# Altium project System.PrjPCB
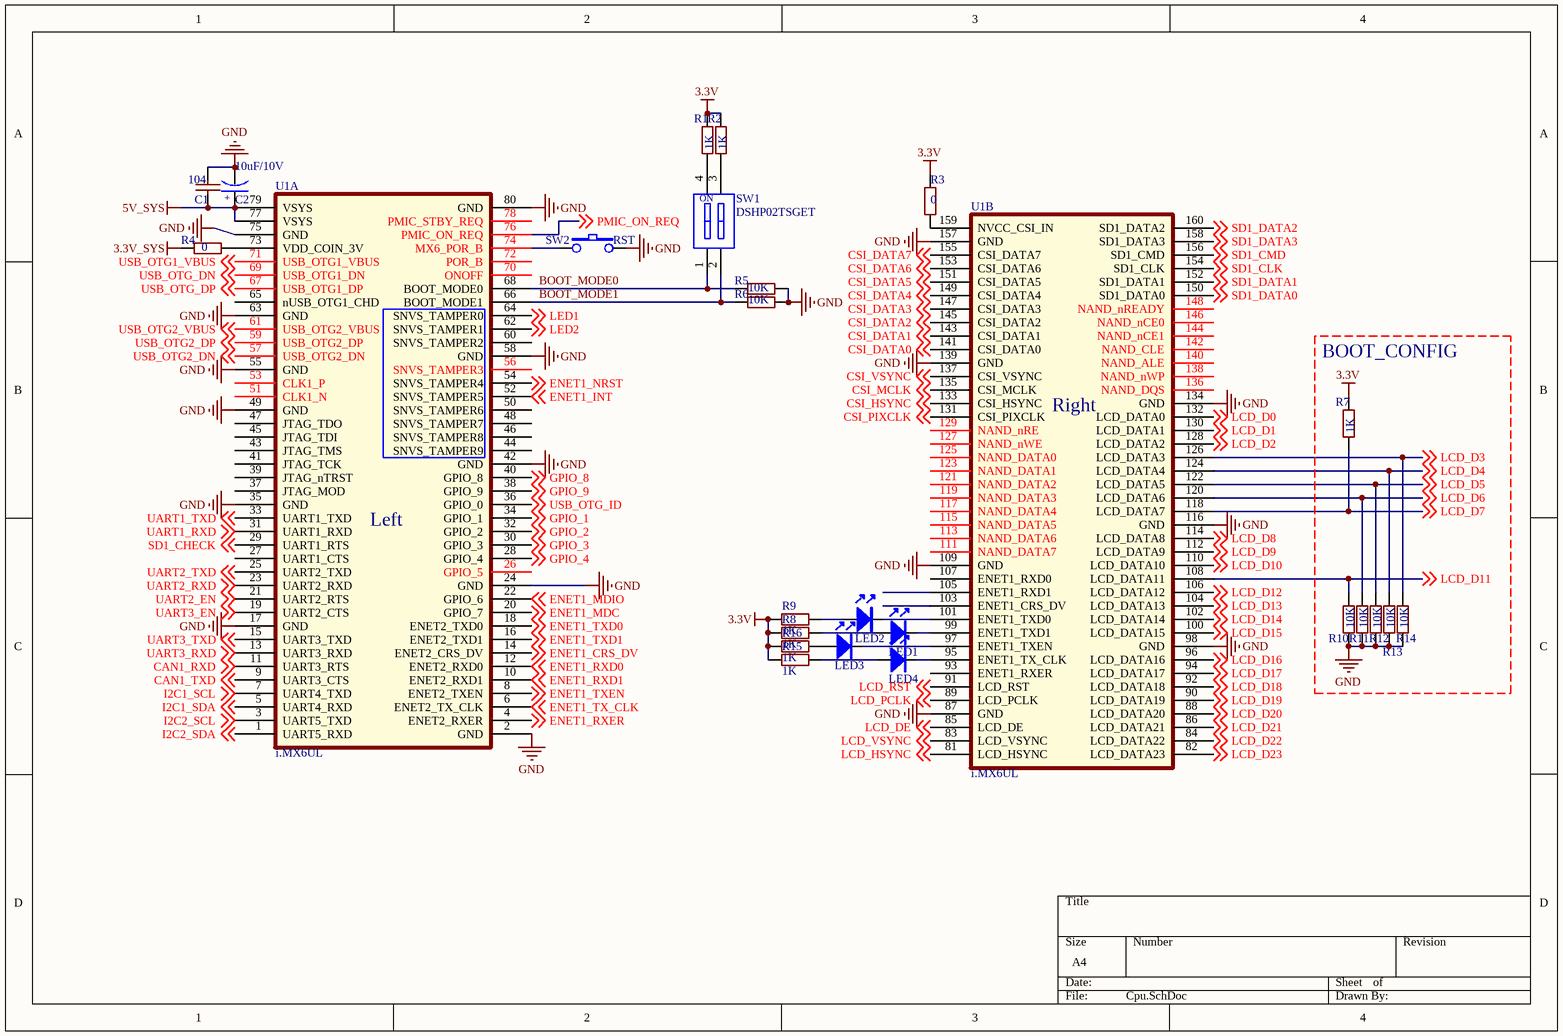
[diagram p0: Cpu.SchDoc]
6 sheets, 152 parts. Net scope: global (net labels, ports and power ports of the same name join across sheets).
Board file: System.PcbDoc
Sheets:
  Cpu.SchDoc
  Net.SchDoc
  Power.SchDoc
  Usb_SdCard.SchDoc
  Uart_Can.SchDoc
  Gpio_RTC.SchDoc

## Sheet Cpu.SchDoc
size A4

### Parts
(Parts that share a designator on the sheet are numbered #1, #2 ... from top to bottom, then left to right.)
C1  104  [0805SMD_Cap]
C2  10uF/10V  [CASE A]
LED1  LED  [发光二极管0805]  (value not drawn)
LED2  LED  [发光二极管0805]  (value not drawn)
LED3  LED  [发光二极管0805]  (value not drawn)
LED4  LED  [发光二极管0805]  (value not drawn)
R1  1K  [0805_SMD_R]
R2  1K  [0805_SMD_R]
R3  0  [0805_SMD_R]
R4  0  [0805_SMD_R]
R5#1  10K  [0805_SMD_R]
R6#1  10K  [0805_SMD_R]
R7#1  1K  [0805_SMD_R]
R8  1K  [0805_SMD_R]
R9  1K  [0805_SMD_R]
R10  10K  [0805_SMD_R]
R11  10K  [0805_SMD_R]
R12  10K  [0805_SMD_R]
R13  10K  [0805_SMD_R]
R14  10K  [0805_SMD_R]
R15  1K  [0805_SMD_R]
R16  1K  [0805_SMD_R]
SW1  DSHP02TSGET  [DSHP02TSGET]
SW2  RST  [SW4]
U1  i.MX6UL  [i.MX6_PCB]  (parts A,B of 2)

### Blocks framed on the sheet
BOOT_CONFIG: R7#1 R10-R14

### Nets
3.3V: R1.2 R2.2 R3.1 R7#1.2 R8.1 R9.1 R15.2 R16.2
3.3V_SYS: R4.2
5V_SYS: C1.2 C2.1 U1.77(VSYS) U1.79(VSYS)
GND: C1.1 C2.2 R5#1.1 R6#1.1 R10.1 R11.1 R12.1 R13.1 R14.1 SW2.2 U1.2(GND) U1.17(GND) U1.24(GND) U1.35(GND) U1.42(GND) U1.49(GND) U1.55(GND) U1.58(GND) U1.63(GND) U1.75(GND) U1.80(GND) U1.87(GND) U1.98(GND) U1.109(GND) U1.116(GND) U1.134(GND) U1.139(GND) U1.157(GND)
BOOT_MODE0: R5#1.2 SW1.1(A1) U1.68(BOOT_MODE0)
BOOT_MODE1: R6#1.2 SW1.2(A2) U1.66(BOOT_MODE1)
CAN1_RXD: U1.11(UART3_RTS) ; off-sheet CAN1_RXD
CAN1_TXD: U1.9(UART3_CTS) ; off-sheet CAN1_TXD
CSI_DATA0: U1.141(CSI_DATA0) ; off-sheet CSI_DATA0
CSI_DATA1: U1.143(CSI_DATA1) ; off-sheet CSI_DATA1
CSI_DATA2: U1.145(CSI_DATA2) ; off-sheet CSI_DATA2
CSI_DATA3: U1.147(CSI_DATA3) ; off-sheet CSI_DATA3
CSI_DATA4: U1.149(CSI_DATA4) ; off-sheet CSI_DATA4
CSI_DATA5: U1.151(CSI_DATA5) ; off-sheet CSI_DATA5
CSI_DATA6: U1.153(CSI_DATA6) ; off-sheet CSI_DATA6
CSI_DATA7: U1.155(CSI_DATA7) ; off-sheet CSI_DATA7
CSI_HSYNC: U1.133(CSI_HSYNC) ; off-sheet CSI_HSYNC
CSI_MCLK: U1.135(CSI_MCLK) ; off-sheet CSI_MCLK
CSI_PIXCLK: U1.131(CSI_PIXCLK) ; off-sheet CSI_PIXCLK
CSI_VSYNC: U1.137(CSI_VSYNC) ; off-sheet CSI_VSYNC
ENET1_CRS_DV: U1.14(ENET2_CRS_DV) ; off-sheet ENET1_CRS_DV
ENET1_INT: U1.52(SNVS_TAMPER5) ; off-sheet ENET1_INT
ENET1_MDC: U1.20(GPIO_7) ; off-sheet ENET1_MDC
ENET1_MDIO: U1.22(GPIO_6) ; off-sheet ENET1_MDIO
ENET1_NRST: U1.54(SNVS_TAMPER4) ; off-sheet ENET1_NRST
ENET1_RXD0: U1.12(ENET2_RXD0) ; off-sheet ENET1_RXD0
ENET1_RXD1: U1.10(ENET2_RXD1) ; off-sheet ENET1_RXD1
ENET1_RXER: U1.4(ENET2_RXER) ; off-sheet ENET1_RXER
ENET1_TX_CLK: U1.6(ENET2_TX_CLK) ; off-sheet ENET1_TX_CLK
ENET1_TXD0: U1.18(ENET2_TXD0) ; off-sheet ENET1_TXD0
ENET1_TXD1: U1.16(ENET2_TXD1) ; off-sheet ENET1_TXD1
ENET1_TXEN: U1.8(ENET2_TXEN) ; off-sheet ENET1_TXEN
GPIO_1: U1.34(GPIO_1) ; off-sheet GPIO_1
GPIO_2: U1.32(GPIO_2) ; off-sheet GPIO_2
GPIO_3: U1.30(GPIO_3) ; off-sheet GPIO_3
GPIO_4: U1.28(GPIO_4) ; off-sheet GPIO_4
GPIO_8: U1.40(GPIO_8) ; off-sheet GPIO_8
GPIO_9: U1.38(GPIO_9) ; off-sheet GPIO_9
I2C1_SCL: U1.7(UART4_TXD) ; off-sheet I2C1_SCL
I2C1_SDA: U1.5(UART4_RXD) ; off-sheet I2C1_SDA
I2C2_SCL: U1.3(UART5_TXD) ; off-sheet I2C2_SCL
I2C2_SDA: U1.1(UART5_RXD) ; off-sheet I2C2_SDA
LCD_D0: U1.132(LCD_DATA0) ; off-sheet LCD_D0
LCD_D1: U1.130(LCD_DATA1) ; off-sheet LCD_D1
LCD_D2: U1.128(LCD_DATA2) ; off-sheet LCD_D2
LCD_D3: R14.2 U1.126(LCD_DATA3) ; off-sheet LCD_D3
LCD_D4: R13.2 U1.124(LCD_DATA4) ; off-sheet LCD_D4
LCD_D5: R12.2 U1.122(LCD_DATA5) ; off-sheet LCD_D5
LCD_D6: R11.2 U1.120(LCD_DATA6) ; off-sheet LCD_D6
LCD_D7: R7#1.1 U1.118(LCD_DATA7) ; off-sheet LCD_D7
LCD_D8: U1.114(LCD_DATA8) ; off-sheet LCD_D8
LCD_D9: U1.112(LCD_DATA9) ; off-sheet LCD_D9
LCD_D10: U1.110(LCD_DATA10) ; off-sheet LCD_D10
LCD_D11: R10.2 U1.108(LCD_DATA11) ; off-sheet LCD_D11
LCD_D12: U1.106(LCD_DATA12) ; off-sheet LCD_D12
LCD_D13: U1.104(LCD_DATA13) ; off-sheet LCD_D13
LCD_D14: U1.102(LCD_DATA14) ; off-sheet LCD_D14
LCD_D15: U1.100(LCD_DATA15) ; off-sheet LCD_D15
LCD_D16: U1.96(LCD_DATA16) ; off-sheet LCD_D16
LCD_D17: U1.94(LCD_DATA17) ; off-sheet LCD_D17
LCD_D18: U1.92(LCD_DATA18) ; off-sheet LCD_D18
LCD_D19: U1.90(LCD_DATA19) ; off-sheet LCD_D19
LCD_D20: U1.88(LCD_DATA20) ; off-sheet LCD_D20
LCD_D21: U1.86(LCD_DATA21) ; off-sheet LCD_D21
LCD_D22: U1.84(LCD_DATA22) ; off-sheet LCD_D22
LCD_D23: U1.82(LCD_DATA23) ; off-sheet LCD_D23
LCD_DE: U1.85(LCD_DE) ; off-sheet LCD_DE
LCD_HSYNC: U1.81(LCD_HSYNC) ; off-sheet LCD_HSYNC
LCD_PCLK: U1.89(LCD_PCLK) ; off-sheet LCD_PCLK
LCD_RST: U1.91(LCD_RST) ; off-sheet LCD_RST
LCD_VSYNC: U1.83(LCD_VSYNC) ; off-sheet LCD_VSYNC
LED1: U1.64(SNVS_TAMPER0) ; off-sheet LED1
LED2: U1.62(SNVS_TAMPER1) ; off-sheet LED2
PMIC_ON_REQ: U1.76(PMIC_ON_REQ) ; off-sheet PMIC_ON_REQ
SD1_CHECK: U1.29(UART1_RTS) ; off-sheet SD1_CHECK
SD1_CLK: U1.154(SD1_CLK) ; off-sheet SD1_CLK
SD1_CMD: U1.156(SD1_CMD) ; off-sheet SD1_CMD
SD1_DATA0: U1.150(SD1_DATA0) ; off-sheet SD1_DATA0
SD1_DATA1: U1.152(SD1_DATA1) ; off-sheet SD1_DATA1
SD1_DATA2: U1.160(SD1_DATA2) ; off-sheet SD1_DATA2
SD1_DATA3: U1.158(SD1_DATA3) ; off-sheet SD1_DATA3
UART1_RXD: U1.31(UART1_RXD) ; off-sheet UART1_RXD
UART1_TXD: U1.33(UART1_TXD) ; off-sheet UART1_TXD
UART2_EN: U1.21(UART2_RTS) ; off-sheet UART2_EN
UART2_RXD: U1.23(UART2_RXD) ; off-sheet UART2_RXD
UART2_TXD: U1.25(UART2_TXD) ; off-sheet UART2_TXD
UART3_EN: U1.19(UART2_CTS) ; off-sheet UART3_EN
UART3_RXD: U1.13(UART3_RXD) ; off-sheet UART3_RXD
UART3_TXD: U1.15(UART3_TXD) ; off-sheet UART3_TXD
USB_OTG1_VBUS: U1.71(USB_OTG1_VBUS) ; off-sheet USB_OTG1_VBUS
USB_OTG2_DN: U1.57(USB_OTG2_DN) ; off-sheet USB_OTG2_DN
USB_OTG2_DP: U1.59(USB_OTG2_DP) ; off-sheet USB_OTG2_DP
USB_OTG2_VBUS: U1.61(USB_OTG2_VBUS) ; off-sheet USB_OTG2_VBUS
USB_OTG_DN: U1.69(USB_OTG1_DN) ; off-sheet USB_OTG_DN
USB_OTG_DP: U1.67(USB_OTG1_DP) ; off-sheet USB_OTG_DP
USB_OTG_ID: U1.36(GPIO_0) ; off-sheet USB_OTG_ID
NetLED1_A: LED1.A R8.2
NetLED1_K: LED1.K U1.99(ENET1_TXD1)
NetLED2_A: LED2.A R9.2
NetLED2_K: LED2.K U1.101(ENET1_TXD0)
NetLED3_A: LED3.A R16.1
NetLED3_K: LED3.K U1.97(ENET1_TXEN)
NetLED4_A: LED4.A R15.1
NetLED4_K: LED4.K U1.95(ENET1_TX_CLK)
NetR1_1: R1.1 SW1.4(B1)
NetR2_1: R2.1 SW1.3(B2)
NetR3_2: R3.2 U1.159(NVCC_CSI_IN)
NetR4_1: R4.1 U1.73(VDD_COIN_3V)
NetSW2_1: SW2.1 U1.74(MX6_POR_B)

Not connected (* = marked no-connect by the designer): U1 26(GPIO_5) 27(UART1_CTS) 37(JTAG_MOD) 39(JTAG_nTRST) 41(JTAG_TCK) 43(JTAG_TMS) 44(SNVS_TAMPER9) 45(JTAG_TDI) 46(SNVS_TAMPER8) 47(JTAG_TDO) 48(SNVS_TAMPER7) 50(SNVS_TAMPER6) 51(CLK1_N) 53(CLK1_P) 56(SNVS_TAMPER3) 60(SNVS_TAMPER2) 65(nUSB_OTG1_CHD) 70(ONOFF) 72(POR_B) 78(PMIC_STBY_REQ) 93(ENET1_RXER) 103(ENET1_CRS_DV) 105(ENET1_RXD1) 107(ENET1_RXD0) 111(NAND_DATA7) 113(NAND_DATA6) 115(NAND_DATA5) 117(NAND_DATA4) 119(NAND_DATA3) 121(NAND_DATA2) 123(NAND_DATA1) 125(NAND_DATA0) 127(NAND_nWE) 129(NAND_nRE) 136(NAND_DQS) 138(NAND_nWP) 140(NAND_ALE) 142(NAND_CLE) 144(NAND_nCE1) 146(NAND_nCE0) 148(NAND_nREADY)

### Notes on the sheet
- (in symbol CAP  POL) +
- (in symbol i.MX6_Sch, part A) Left
- (in symbol i.MX6_Sch, part B) Right
- (in symbol 拨码开关) ON

### Library data of the parts
C1 = SMD_Cap: 贴片电容; 研究所: 贴装电容_0805_0.1uF; 松下: GR21BB1H104K; 松下: GR21BB1H224K; 松下: GR21BB1H103K; 研究所: 贴装电容_0805_0.22uF; 研究所: 贴装电容_0805_0.01uF; 松下: GR21BB1H473K; 研究所: 贴装电容_0805_0.047uF; 松下: GR21BB1H300K; 研究所: 贴装电容_0805_30pF; 松下: GR21BB1H105K; 研究所: 贴装电容_0805_1uF; 松下: GR21BB1H472K; 研究所: 贴装电容_0805_4700pF
C2 = CAP  POL: 电解电容; Value: R1HCX010MT50
LED1-LED4 = LED: 发光二极管
R1-R4 R5#1 R6#1 R7#1 R8-R16 = SMD_0805: 贴片电阻; 松下: RS05K101FT; 松下: RS05000FT; 松下: RS05K3321FT; 松下: RS05K6811FT; 松下: RS05K102FT; 松下: RS05K2211FT; 松下: RS05K103FT; 松下: RS05K5111FT; 松下: RS05K5110FT; 松下: RS05K5112FT; 松下: RS05K8251FT; 松下: RS05K2212FT; 松下: RS05K104FT; 松下: RS05K5113FT; 松下: RS05K105FT; 松下: RS05L106FT; 研究所: 贴装电阻_0805_0_F1%; 研究所: 贴装电阻_0805_100_F1%; 研究所: 贴装电阻_0805_51.1K_F1%; 研究所: 贴装电阻_0805_1K_F1%; 研究所: 贴装电阻_0805_2.21K_F1%; 研究所: 贴装电阻_0805_3.32K_F1%; 研究所: 贴装电阻_0805_5.11K_F1%; 研究所: 贴装电阻_0805_511K_F1%; 研究所: 贴装电阻_0805_6.81K_F1%; 研究所: 贴装电阻_0805_511_F1%; 研究所: 贴装电阻_0805_8.25K_F1%; 研究所: 贴装电阻_0805_10K_F1%; 研究所: 贴装电阻_0805_22.1K_F1%; 研究所: 贴装电阻_0805_100K_F1%; 研究所: 贴装电阻_0805_1M_F1%; 研究所: 贴装电阻_0805_10M_F1%
SW1 = 拨码开关
SW2 = Button: 按键12*12*7.3
U1 = i.MX6_Sch

## Sheet Net.SchDoc: 网络接口
size A4; Author: 陈世豪
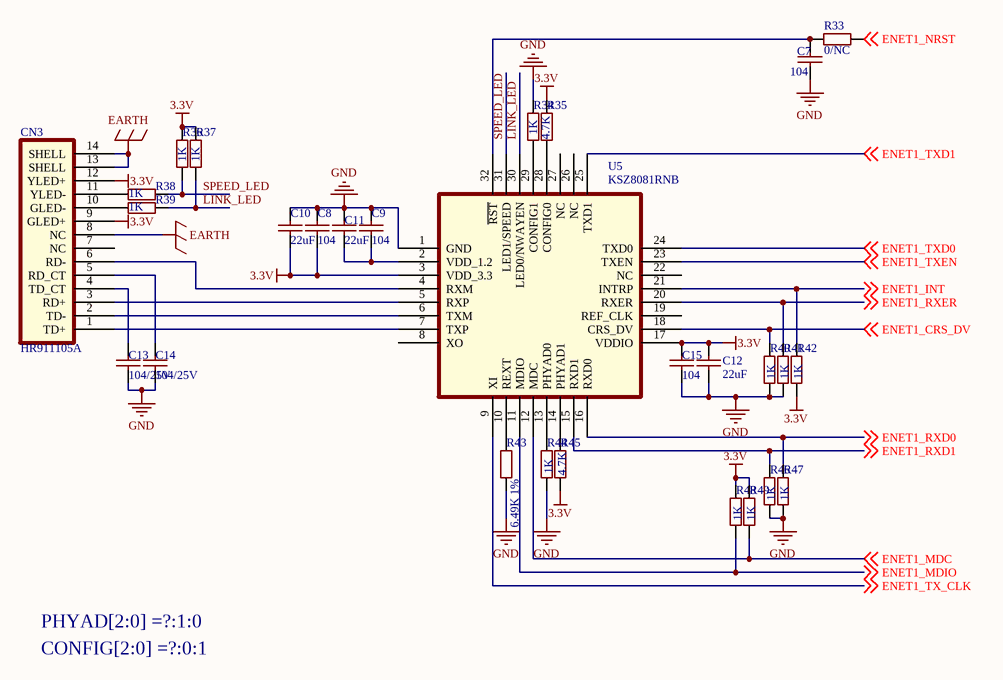
[diagram p1: Net.SchDoc]

### Parts
C7  104  [0805SMD_Cap]
C8  104  [0805SMD_Cap]
C9  104  [0805SMD_Cap]
C10  22uF  [0805SMD_Cap]
C11  22uF  [0805SMD_Cap]
C12  22uF  [0805SMD_Cap]
C13  104/25V  [0805SMD_Cap]
C14  104/25V  [0805SMD_Cap]
C15  104  [0805SMD_Cap]
CN3  HR911105A  [RJ-45A12]
R33  0/NC  [0805_SMD_R]
R34  1K  [0805_SMD_R]
R35  4.7K  [0805_SMD_R]
R36  1K  [0805_SMD_R]
R37  1K  [0805_SMD_R]
R38  1K  [0805_SMD_R]
R39  1K  [0805_SMD_R]
R40  1K  [0805_SMD_R]
R41  1K  [0805_SMD_R]
R42  1K  [0805_SMD_R]
R43  6.49K 1%  [0805_SMD_R]
R44  1K  [0805_SMD_R]
R45  4.7K  [0805_SMD_R]
R46  1K  [0805_SMD_R]
R47  1K  [0805_SMD_R]
R48  1K  [0805_SMD_R]
R49  1K  [0805_SMD_R]
U5  KSZ8081RNB  [LC-QFN-32_5x5x05P]

### Nets
3.3V: C8.2 C10.1 C12.1 C15.2 CN3.9(GLED+) CN3.12(YLED+) R35.2 R36.2 R37.2 R42.2 R45.2 R48.2 R49.2 U5.3(VDD_3.3) U5.17(VDDIO)
EARTH: CN3.8(NC) CN3.13(SHELL) CN3.14(SHELL)
GND: C7.1 C8.1 C9.1 C10.2 C11.2 C12.2 C13.1 C14.1 C15.1 R34.2 R40.1 R41.1 R43.1 R44.1 R46.1 R47.1 U5.1(GND)
ENET1_CRS_DV: R40.2 U5.18(CRS_DV) ; off-sheet ENET1_CRS_DV
ENET1_INT: R42.1 U5.21(INTRP) ; off-sheet ENET1_INT
ENET1_MDC: R49.1 U5.12(MDC) ; off-sheet ENET1_MDC
ENET1_MDIO: R48.1 U5.11(MDIO) ; off-sheet ENET1_MDIO
ENET1_NRST: R33.1 ; off-sheet ENET1_NRST
ENET1_RXD0: R47.2 U5.16(RXD0) ; off-sheet ENET1_RXD0
ENET1_RXD1: R46.2 U5.15(RXD1) ; off-sheet ENET1_RXD1
ENET1_RXER: R41.2 U5.20(RXER) ; off-sheet ENET1_RXER
ENET1_TX_CLK: U5.9(XI) ; off-sheet ENET1_TX_CLK
ENET1_TXD0: U5.24(TXD0) ; off-sheet ENET1_TXD0
ENET1_TXD1: U5.25(TXD1) ; off-sheet ENET1_TXD1
ENET1_TXEN: U5.23(TXEN) ; off-sheet ENET1_TXEN
LINK_LED: R37.1 R39.2 U5.30(LED0/NWAYEN)
SPEED_LED: R36.1 R38.2 U5.31(LED1/SPEED)
NetC7_2: C7.2 R33.2 U5.32(~{RST})
NetC9_2: C9.2 C11.1 U5.2(VDD_1.2)
NetC13_2: C13.2 CN3.4(TD_CT)
NetC14_2: C14.2 CN3.5(RD_CT)
NetCN3_1: CN3.1(TD+) U5.7(TXP)
NetCN3_2: CN3.2(TD-) U5.6(TXM)
NetCN3_3: CN3.3(RD+) U5.5(RXP)
NetCN3_6: CN3.6(RD-) U5.4(RXM)
NetCN3_10: CN3.10(GLED-) R39.1
NetCN3_11: CN3.11(YLED-) R38.1
NetR34_1: R34.1 U5.29(CONFIG1)
NetR35_1: R35.1 U5.28(CONFIG0)
NetR43_2: R43.2 U5.10(REXT)
NetR44_2: R44.2 U5.13(PHYAD0)
NetR45_1: R45.1 U5.14(PHYAD1)

Not connected (* = marked no-connect by the designer): CN3 7(NC); U5 8(XO) 19(REF_CLK) 22(NC) 26(NC) 27(NC)

### Notes on the sheet
- PHYAD[2:0] =?:1:0
- CONFIG[2:0] =?:0:1

### Library data of the parts
C7-C15 = SMD_Cap: 贴片电容; 研究所: 贴装电容_0805_4700pF; 松下: GR21BB1H472K
R33-R49 = SMD_0805: as R1 on sheet Cpu

## Sheet Power.SchDoc
size A4
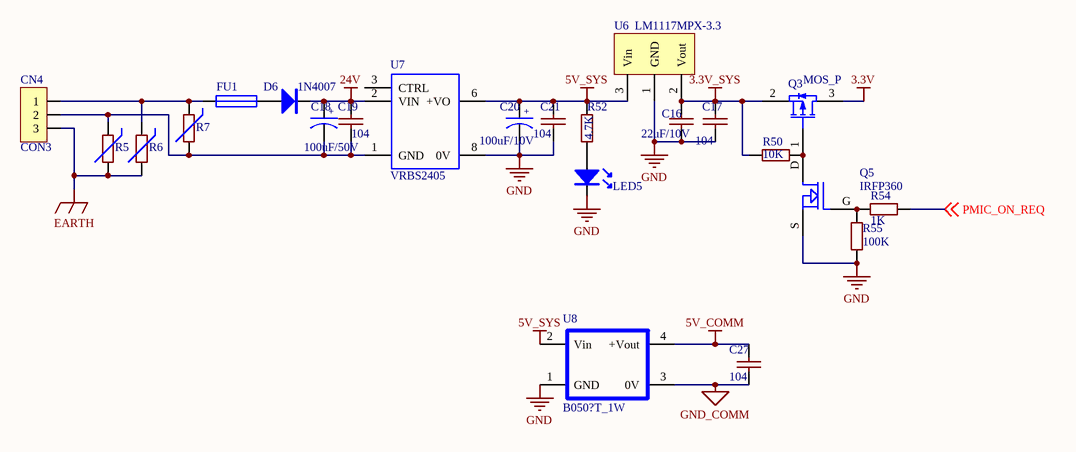
[diagram p2: Power.SchDoc]

### Parts
(Parts that share a designator on the sheet are numbered #1, #2 ... from top to bottom, then left to right.)
C16  22uF/10V  [0805SMD_Cap]
C17  104  [0805SMD_Cap]
C18  100uF/50V  [电解电容-10]
C19  104  [0805SMD_Cap]
C20  100uF/10V  [电解电容-10]
C21  104  [0805SMD_Cap]
C27  104  [0805SMD_Cap]
CN4  CON3  [WJ15EDGRM-3.81-3P-14-00A]
D6  1N4007  [二极管SMA]
FU1  FUSE1  [RAD0.2]  (value not drawn)
LED5  LED  [发光二极管0805]  (value not drawn)
Q3  MOS_P  [SOT-23]
Q5  IRFP360  [SOT-23 - MOS]
R5#2  10d330K  [RAD0.2]  (value not drawn)
R6#2  10d330K  [RAD0.2]  (value not drawn)
R7#2  10d330K  [RAD0.2]  (value not drawn)
R50  10K  [0805_SMD_R]
R52  4.7K  [0805_SMD_R]
R54  1K  [0805_SMD_R]
R55  100K  [0805_SMD_R]
U6  LM1117MPX-3.3  [SOT-223]
U7  VRBS2405  [VRB_S]
U8  B050?T_1W  [B0505S_1W]

### Nets
3.3V: Q3.3(D)
3.3V_SYS: C16.1 C17.1 Q3.2(S) R50.2 U6.2(Vout)
5V_COMM: C27.1 U8.4(+Vout)
5V_SYS: C20.1 C21.1 R52.2 U6.3(Vin) U7.6(+VO) U8.2(Vin)
24V: C18.1 C19.1 D6.K U7.2(VIN)
EARTH: CN4.3 R5#2.1 R6#2.1
GND: C16.2 C17.2 C20.2 C21.2 LED5.K Q5.S(SOURCE) R55.2 U6.1(GND) U7.8(0V) U8.1(GND)
GND_COMM: C27.2 U8.3(0V)
PMIC_ON_REQ: R54.1 ; off-sheet PMIC_ON_REQ
NetC18_2: C18.2 C19.2 CN4.2 R5#2.2 R7#2.1 U7.1(GND)
NetCN4_1: CN4.1 FU1.1 R6#2.2 R7#2.2
NetD6_A: D6.A FU1.2
NetLED5_A: LED5.A R52.1
NetQ3_1: Q3.1(G) Q5.D(DRAIN) R50.1
NetQ5_G: Q5.G(GATE) R54.2 R55.1

Not connected (* = marked no-connect by the designer): U7 3(CTRL) 5(NC) 7(NC)

### Notes on the sheet
- (in symbol CAP  POL) +

### Library data of the parts
C16 = SMD_Cap: as C7 on sheet Net
C17 C19 C21 C27 = SMD_Cap: as C1 on sheet Cpu
C18 C20 = CAP  POL: 电解电容; Value: R1HCX010MT50
CN4 = CON3: 连接器; 松下: B3PVHB
D6 = DIODE: 二极管
FU1 = FUSE1: 保险
LED5 = LED: 发光二极管
Q5 = MOSFET N: MOS管
R5#2 R6#2 R7#2 = 压敏电阻: 松下: RS05K101FT; 松下: RS05000FT; 松下: RS05K3321FT; 松下: RS05K6811FT; 松下: RS05K102FT; 松下: RS05K2211FT; 松下: RS05K103FT; 松下: RS05K5111FT; 松下: RS05K5110FT; 松下: RS05K5112FT; 松下: RS05K8251FT; 松下: RS05K2212FT; 松下: RS05K104FT; 松下: RS05K5113FT; 松下: RS05K105FT; 松下: RS05L106FT; 研究所: 贴装电阻_0805_0_F1%; 研究所: 贴装电阻_0805_100_F1%; 研究所: 贴装电阻_0805_51.1K_F1%; 研究所: 贴装电阻_0805_1K_F1%; 研究所: 贴装电阻_0805_2.21K_F1%; 研究所: 贴装电阻_0805_3.32K_F1%; 研究所: 贴装电阻_0805_5.11K_F1%; 研究所: 贴装电阻_0805_511K_F1%; 研究所: 贴装电阻_0805_6.81K_F1%; 研究所: 贴装电阻_0805_511_F1%; 研究所: 贴装电阻_0805_8.25K_F1%; 研究所: 贴装电阻_0805_10K_F1%; 研究所: 贴装电阻_0805_22.1K_F1%; 研究所: 贴装电阻_0805_100K_F1%; 研究所: 贴装电阻_0805_1M_F1%; 研究所: 贴装电阻_0805_10M_F1%
R50 R52 R54 R55 = SMD_0805: as R1 on sheet Cpu
U6 = LM1117MPX-3.3: LM1117 3.3V固定输出; 编号: B00004; 名称: 贴装芯片_LM1117MPX-3.3
U8 = B0505S_1W

## Sheet Usb_SdCard.SchDoc
size A4
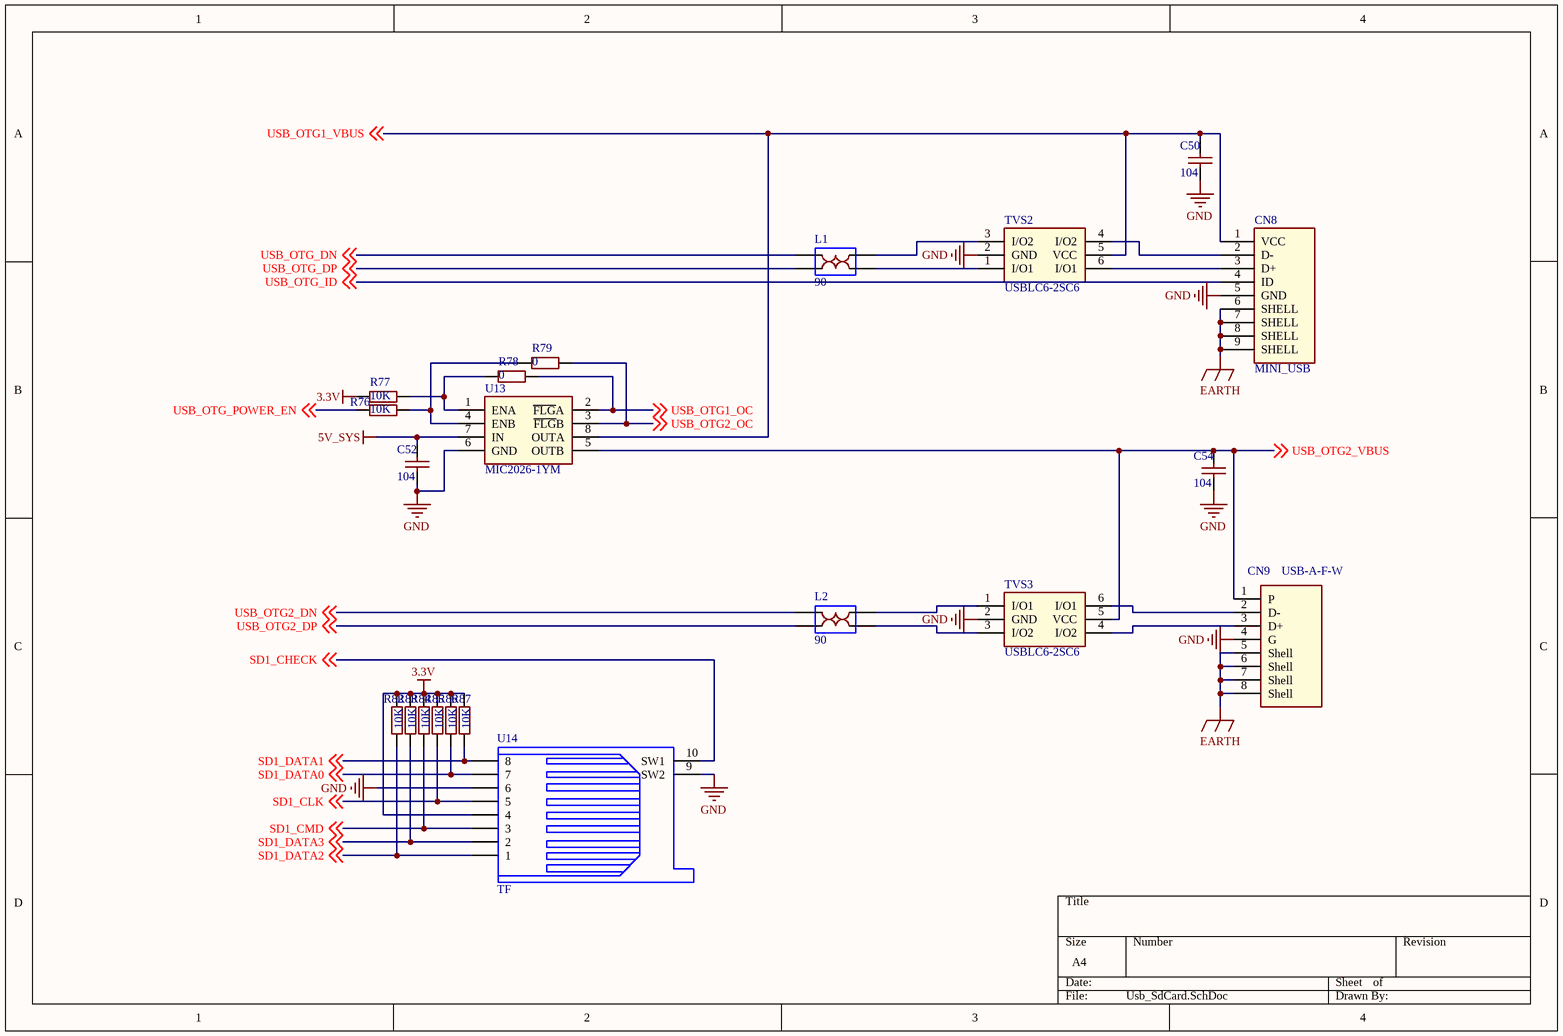
[diagram p3: Usb_SdCard.SchDoc]

### Parts
C50  104  [0805SMD_Cap]
C52  104  [0805SMD_Cap]
C54  104  [0805SMD_Cap]
CN8  MINI_USB  [MICRO_USB]
CN9  USB-A-F-W  [USB-C]
L1  90  [2012]
L2  90  [2012]
R76  10K  [0805_SMD_R]
R77  10K  [0805_SMD_R]
R78  0  [0805_SMD_R]
R79  0  [0805_SMD_R]
R82  10K  [0805_SMD_R]
R83  10K  [0805_SMD_R]
R84  10K  [0805_SMD_R]
R85  10K  [0805_SMD_R]
R86  10K  [0805_SMD_R]
R87  10K  [0805_SMD_R]
TVS2  USBLC6-2SC6  [SOT-23-6]
TVS3  USBLC6-2SC6  [SOT-23-6]
U13  MIC2026-1YM  [运放SO8]
U14  TF  [TF]

### Nets
3.3V: R77.2 R82.2 R83.2 R84.2 R85.2 R86.2 R87.2 U14.4
5V_SYS: C52.1 U13.7(IN)
EARTH: CN8.6(SHELL) CN8.7(SHELL) CN8.8(SHELL) CN8.9(SHELL) CN9.5(Shell) CN9.6(Shell) CN9.7(Shell) CN9.8(Shell)
GND: C50.2 C52.2 C54.2 CN8.5(GND) CN9.4(G) TVS2.2(GND) TVS3.2(GND) U13.6(GND) U14.6 U14.9(SW2)
SD1_CHECK: U14.10(SW1) ; off-sheet SD1_CHECK
SD1_CLK: R85.1 U14.5 ; off-sheet SD1_CLK
SD1_CMD: R84.1 U14.3 ; off-sheet SD1_CMD
SD1_DATA0: R86.1 U14.7 ; off-sheet SD1_DATA0
SD1_DATA1: R87.1 U14.8 ; off-sheet SD1_DATA1
SD1_DATA2: R82.1 U14.1 ; off-sheet SD1_DATA2
SD1_DATA3: R83.1 U14.2 ; off-sheet SD1_DATA3
USB_OTG1_OC: R78.1 U13.2(~{FLG}A) ; off-sheet USB_OTG1_OC
USB_OTG1_VBUS: C50.1 CN8.1(VCC) TVS2.5(VCC) U13.8(OUTA) ; off-sheet USB_OTG1_VBUS
USB_OTG2_DN: L2.1 ; off-sheet USB_OTG2_DN
USB_OTG2_DP: L2.2 ; off-sheet USB_OTG2_DP
USB_OTG2_OC: R79.1 U13.3(~{FLG}B) ; off-sheet USB_OTG2_OC
USB_OTG2_VBUS: C54.1 CN9.1(P) TVS3.5(VCC) U13.5(OUTB) ; off-sheet USB_OTG2_VBUS
USB_OTG_DN: L1.2 ; off-sheet USB_OTG_DN
USB_OTG_DP: L1.1 ; off-sheet USB_OTG_DP
USB_OTG_ID: CN8.4(ID) ; off-sheet USB_OTG_ID
USB_OTG_POWER_EN: R76.2 ; off-sheet USB_OTG_POWER_EN
NetCN8_2: CN8.2(D-) TVS2.4(I/O2)
NetCN8_3: CN8.3(D+) TVS2.6(I/O1)
NetCN9_2: CN9.2(D-) TVS3.6(I/O1)
NetCN9_3: CN9.3(D+) TVS3.4(I/O2)
NetL1_3: L1.3 TVS2.3(I/O2)
NetL1_4: L1.4 TVS2.1(I/O1)
NetL2_3: L2.3 TVS3.3(I/O2)
NetL2_4: L2.4 TVS3.1(I/O1)
NetR76_1: R76.1 R79.2 U13.4(ENB)
NetR77_1: R77.1 R78.2 U13.1(ENA)

### Library data of the parts
C50 C52 C54 = SMD_Cap: as C1 on sheet Cpu
L1 L2 = 共模电感
R76-R79 R82-R87 = SMD_0805: as R1 on sheet Cpu

## Sheet Uart_Can.SchDoc
size A4
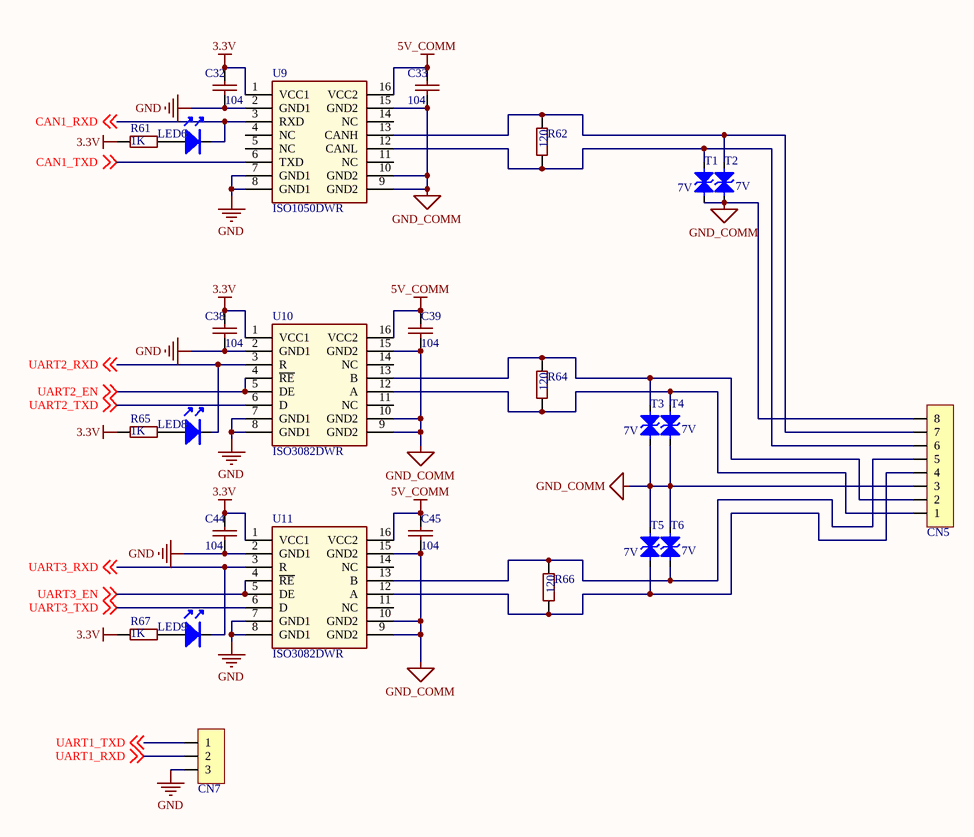
[diagram p4: Uart_Can.SchDoc]

### Parts
C32  104  [0805SMD_Cap]
C33  104  [0805SMD_Cap]
C38  104  [0805SMD_Cap]
C39  104  [0805SMD_Cap]
C44  104  [0805SMD_Cap]
C45  104  [0805SMD_Cap]
CN5  CON8  [WJ15EDGRM-3.81-8P]  (value not drawn)
CN7  CON3  [DIP3]  (value not drawn)
LED6  LED  [发光二极管0805]  (value not drawn)
LED8  LED  [发光二极管0805]  (value not drawn)
LED9  LED  [发光二极管0805]  (value not drawn)
R61  1K  [0805_SMD_R]
R62  120  [0805_SMD_R]
R64  120  [0805_SMD_R]
R65  1K  [0805_SMD_R]
R66  120  [0805_SMD_R]
R67  1K  [0805_SMD_R]
T1  7V  [二极管SMA]
T2  7V  [二极管SMA]
T3  7V  [二极管SMA]
T4  7V  [二极管SMA]
T5  7V  [二极管SMA]
T6  7V  [二极管SMA]
U9  ISO1050DWR  [SOIC_16]
U10  ISO3082DWR  [SOIC_16]
U11  ISO3082DWR  [SOIC_16]

### Nets
3.3V: C32.2 C38.2 C44.2 R61.2 R65.2 R67.2 U9.1(VCC1) U10.1(VCC1) U11.1(VCC1)
5V_COMM: C33.2 C39.2 C45.2 U9.16(VCC2) U10.16(VCC2) U11.16(VCC2)
GND: C32.1 C38.1 C44.1 CN7.3 U9.2(GND1) U9.7(GND1) U9.8(GND1) U10.2(GND1) U10.7(GND1) U10.8(GND1) U11.2(GND1) U11.7(GND1) U11.8(GND1)
GND_COMM: C33.1 C39.1 C45.1 CN5.3 CN5.8 T1.A T2.A T3.A T4.A T5.K T6.K U9.9(GND2) U9.10(GND2) U9.15(GND2) U10.9(GND2) U10.10(GND2) U10.15(GND2) U11.9(GND2) U11.10(GND2) U11.15(GND2)
CAN1_RXD: LED6.K U9.3(RXD) ; off-sheet CAN1_RXD
CAN1_TXD: U9.6(TXD) ; off-sheet CAN1_TXD
UART1_RXD: CN7.2 ; off-sheet UART1_RXD
UART1_TXD: CN7.1 ; off-sheet UART1_TXD
UART2_EN: U10.4(~{RE}) U10.5(DE) ; off-sheet UART2_EN
UART2_RXD: LED8.K U10.3(R) ; off-sheet UART2_RXD
UART2_TXD: U10.6(D) ; off-sheet UART2_TXD
UART3_EN: U11.4(~{RE}) U11.5(DE) ; off-sheet UART3_EN
UART3_RXD: LED9.K U11.3(R) ; off-sheet UART3_RXD
UART3_TXD: U11.6(D) ; off-sheet UART3_TXD
NetCN5_1: CN5.1 R64.1 T4.K U10.12(A)
NetCN5_2: CN5.2 R64.2 T3.K U10.13(B)
NetCN5_4: CN5.4 R66.1 T5.A U11.12(A)
NetCN5_5: CN5.5 R66.2 T6.A U11.13(B)
NetCN5_6: CN5.6 R62.1 T1.K U9.12(CANL)
NetCN5_7: CN5.7 R62.2 T2.K U9.13(CANH)
NetLED6_A: LED6.A R61.1
NetLED8_A: LED8.A R65.1
NetLED9_A: LED9.A R67.1

Not connected (* = marked no-connect by the designer): U9 4(NC) 5(NC) 11(NC) 14(NC); U10 11(NC) 14(NC); U11 11(NC) 14(NC)

### Library data of the parts
C32 C33 C38 C39 C44 C45 = SMD_Cap: as C1 on sheet Cpu
CN5 = CON8: 连接器; 松下: B9PVHB
CN7 = CON3: 连接器; 松下: B3PVHB
LED6 LED8 LED9 = LED: 发光二极管
R61 R62 R64-R67 = SMD_0805: as R1 on sheet Cpu
T1-T6 = 双向TVS_?V(SMA): 名称: 贴装元件_双向TVS_7V(SMA)
U9 = ISO1050DWR: CAN隔离芯片
U10 U11 = ISO3082DWR: 485隔离芯片

## Sheet Gpio_RTC.SchDoc
size A4
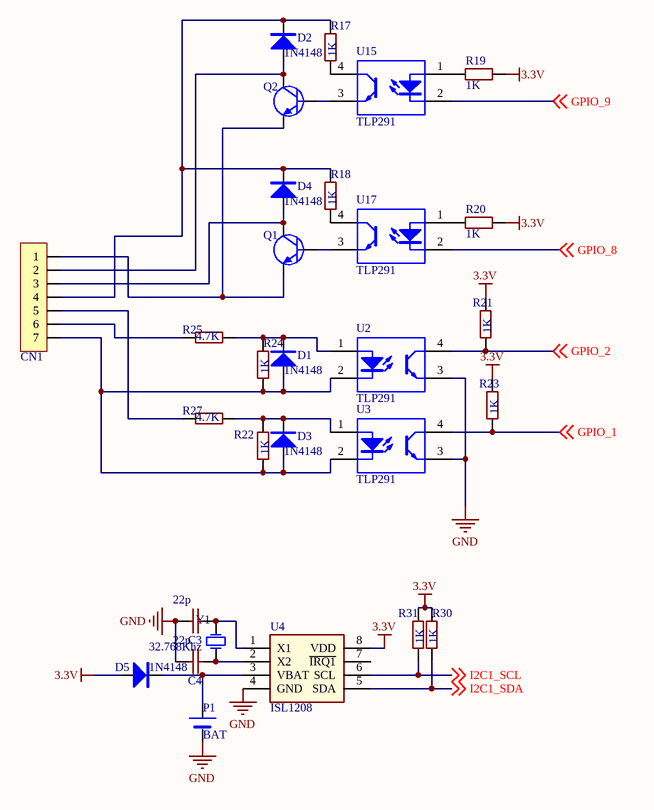
[diagram p5: Gpio_RTC.SchDoc]

### Parts
C3  22p  [0805SMD_Cap]
C4  22p  [0805SMD_Cap]
CN1  CON7  [WJ15EDGRM-3.81-7P]  (value not drawn)
D1  1N4148  [二极管SOD-123]
D2  1N4148  [二极管SOD-123]
D3  1N4148  [二极管SOD-123]
D4  1N4148  [二极管SOD-123]
D5  1N4148  [二极管SOD-123]
P1  BAT  [CR1220]
Q1  1318  [SOT-23]  (value not drawn)
Q2  1318  [SOT-23]  (value not drawn)
R17  1K  [0805_SMD_R]
R18  1K  [0805_SMD_R]
R19  1K  [0805_SMD_R]
R20  1K  [0805_SMD_R]
R21  1K  [0805_SMD_R]
R22  1K  [0805_SMD_R]
R23  1K  [0805_SMD_R]
R24  1K  [0805_SMD_R]
R25  4.7K  [0805_SMD_R]
R27  4.7K  [0805_SMD_R]
R30  1K  [0805_SMD_R]
R31  1K  [0805_SMD_R]
U2  TLP291  [sop-4]
U3  TLP291  [sop-4]
U4  ISL1208  [运放SO8]
U15  TLP291  [sop-4]
U17  TLP291  [sop-4]
Y1  32.768Khz  [XTAL_0503_2Pin]

### Nets
3.3V: D5.A R19.1 R20.1 R21.2 R23.2 R30.1 R31.1 U4.8(VDD)
GND: C3.1 C4.1 P1.2(-) U2.3 U3.3 U4.4(GND)
GPIO_1: R23.1 U3.4 ; off-sheet GPIO_1
GPIO_2: R21.1 U2.4 ; off-sheet GPIO_2
GPIO_8: U17.2 ; off-sheet GPIO_8
GPIO_9: U15.2 ; off-sheet GPIO_9
I2C1_SCL: R31.2 U4.6(SCL) ; off-sheet I2C1_SCL
I2C1_SDA: R30.2 U4.5(SDA) ; off-sheet I2C1_SDA
NetC3_2: C3.2 U4.1(X1) Y1.2(OSC2)
NetC4_2: C4.2 U4.2(X2) Y1.1(OSC1)
NetCN1_1: CN1.1 Q1.2(E) Q2.2(E)
NetCN1_2: CN1.2 D2.A Q2.3(C)
NetCN1_3: CN1.3 D4.A Q1.3(C)
NetCN1_4: CN1.4 D2.K D4.K R17.2 R18.2
NetCN1_5: CN1.5 R27.1
NetCN1_6: CN1.6 R25.1
NetCN1_7: CN1.7 D1.A D3.A R22.1 R24.1 U2.2 U3.2
NetD1_K: D1.K R24.2 R25.2 U2.1
NetD3_K: D3.K R22.2 R27.2 U3.1
NetD5_K: D5.K P1.1(+) U4.3(VBAT)
NetQ1_1: Q1.1(B) U17.3
NetQ2_1: Q2.1(B) U15.3
NetR17_1: R17.1 U15.4
NetR18_1: R18.1 U17.4
NetR19_2: R19.2 U15.1
NetR20_2: R20.2 U17.1

Not connected (* = marked no-connect by the designer): U4 7(~{IR}~{Q1})

### Library data of the parts
C3 C4 = SMD_Cap: as C1 on sheet Cpu
CN1 = CON7: 连接器; 松下: B6BXH2TV4
D1-D5 = DIODE: 二极管
Q1 Q2 = 三极管: Published: 8-Jun-2000; LatestRevisionDate: 17-Jul-2002; LatestRevisionNote: Re-released for DXP Platform.; PackageReference: TO-226; Publisher: Altium Limited; Code_JEDEC: TO-226-AA
R17-R25 R27 R30 R31 = SMD_0805: as R1 on sheet Cpu
U4 = ISL1208: 时钟芯片
Y1 = XTAL: 无源晶振贴装; Published: 8-Jun-2000; LatestRevisionDate: 17-Jul-2002; LatestRevisionNote: Re-released for DXP Platform.; PackageReference: R38; Publisher: Altium Limited

## Nets that join several sheets
3.3V: Cpu (8 pins), Net (15 pins), Power (Q3.3), Usb_SdCard (8 pins), Uart_Can (9 pins), Gpio_RTC (8 pins)
3.3V_SYS: Cpu (R4.2), Power (5 pins)
5V_COMM: Power (C27.1 U8.4), Uart_Can (6 pins)
5V_SYS: Cpu (C1.2 C2.1 U1.77 U1.79), Power (6 pins), Usb_SdCard (C52.1 U13.7)
EARTH: Net (CN3.8 CN3.13 CN3.14), Power (CN4.3 R5#2.1 R6#2.1), Usb_SdCard (8 pins)
GND: Cpu (28 pins), Net (17 pins), Power (10 pins), Usb_SdCard (10 pins), Uart_Can (13 pins), Gpio_RTC (6 pins)
GND_COMM: Power (C27.2 U8.3), Uart_Can (20 pins)
CAN1_RXD: Cpu (U1.11), Uart_Can (LED6.K U9.3)
CAN1_TXD: Cpu (U1.9), Uart_Can (U9.6)
ENET1_CRS_DV: Cpu (U1.14), Net (R40.2 U5.18)
ENET1_INT: Cpu (U1.52), Net (R42.1 U5.21)
ENET1_MDC: Cpu (U1.20), Net (R49.1 U5.12)
ENET1_MDIO: Cpu (U1.22), Net (R48.1 U5.11)
ENET1_NRST: Cpu (U1.54), Net (R33.1)
ENET1_RXD0: Cpu (U1.12), Net (R47.2 U5.16)
ENET1_RXD1: Cpu (U1.10), Net (R46.2 U5.15)
ENET1_RXER: Cpu (U1.4), Net (R41.2 U5.20)
ENET1_TX_CLK: Cpu (U1.6), Net (U5.9)
ENET1_TXD0: Cpu (U1.18), Net (U5.24)
ENET1_TXD1: Cpu (U1.16), Net (U5.25)
ENET1_TXEN: Cpu (U1.8), Net (U5.23)
GPIO_1: Cpu (U1.34), Gpio_RTC (R23.1 U3.4)
GPIO_2: Cpu (U1.32), Gpio_RTC (R21.1 U2.4)
GPIO_8: Cpu (U1.40), Gpio_RTC (U17.2)
GPIO_9: Cpu (U1.38), Gpio_RTC (U15.2)
I2C1_SCL: Cpu (U1.7), Gpio_RTC (R31.2 U4.6)
I2C1_SDA: Cpu (U1.5), Gpio_RTC (R30.2 U4.5)
PMIC_ON_REQ: Cpu (U1.76), Power (R54.1)
SD1_CHECK: Cpu (U1.29), Usb_SdCard (U14.10)
SD1_CLK: Cpu (U1.154), Usb_SdCard (R85.1 U14.5)
SD1_CMD: Cpu (U1.156), Usb_SdCard (R84.1 U14.3)
SD1_DATA0: Cpu (U1.150), Usb_SdCard (R86.1 U14.7)
SD1_DATA1: Cpu (U1.152), Usb_SdCard (R87.1 U14.8)
SD1_DATA2: Cpu (U1.160), Usb_SdCard (R82.1 U14.1)
SD1_DATA3: Cpu (U1.158), Usb_SdCard (R83.1 U14.2)
UART1_RXD: Cpu (U1.31), Uart_Can (CN7.2)
UART1_TXD: Cpu (U1.33), Uart_Can (CN7.1)
UART2_EN: Cpu (U1.21), Uart_Can (U10.4 U10.5)
UART2_RXD: Cpu (U1.23), Uart_Can (LED8.K U10.3)
UART2_TXD: Cpu (U1.25), Uart_Can (U10.6)
UART3_EN: Cpu (U1.19), Uart_Can (U11.4 U11.5)
UART3_RXD: Cpu (U1.13), Uart_Can (LED9.K U11.3)
UART3_TXD: Cpu (U1.15), Uart_Can (U11.6)
USB_OTG1_VBUS: Cpu (U1.71), Usb_SdCard (C50.1 CN8.1 TVS2.5 U13.8)
USB_OTG2_DN: Cpu (U1.57), Usb_SdCard (L2.1)
USB_OTG2_DP: Cpu (U1.59), Usb_SdCard (L2.2)
USB_OTG2_VBUS: Cpu (U1.61), Usb_SdCard (C54.1 CN9.1 TVS3.5 U13.5)
USB_OTG_DN: Cpu (U1.69), Usb_SdCard (L1.2)
USB_OTG_DP: Cpu (U1.67), Usb_SdCard (L1.1)
USB_OTG_ID: Cpu (U1.36), Usb_SdCard (CN8.4)